# EAGLE schematic board1 (EAGLE 5.11)
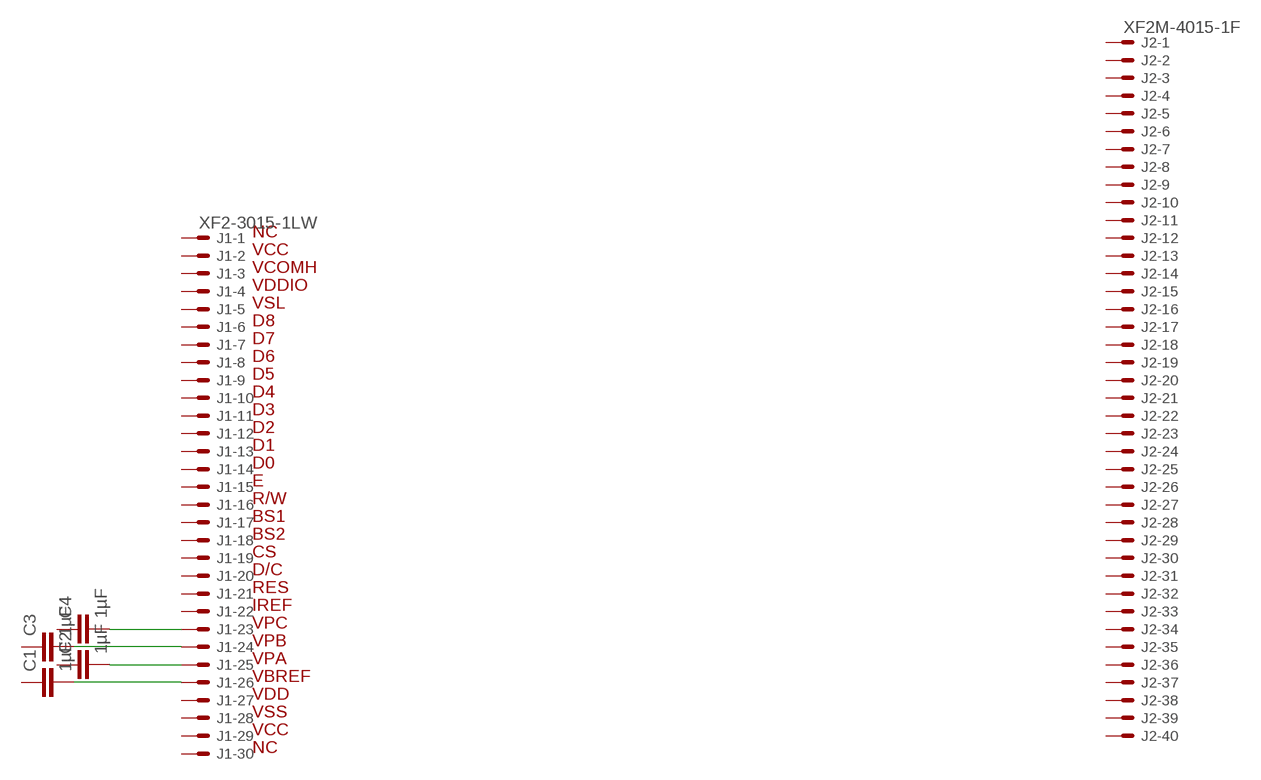
[diagram p0: schematic, sheet 1]

## Parts
C1  1µF  CAP0805  [0805]
C2  1µF  CAP0805  [0805]
C3  1µF  CAP0805  [0805]
C4  1µF  CAP0805  [0805]
J1  XF2-3015-1LW  [XF2H-3015-1LW]
J2  XF2M-4015-1F  [XF2M-4015-1F]

## Nets
N$1: C4.2 J1.23
N$2: C3.2 J1.24
N$3: C2.2 J1.25
N$4: C1.2 J1.26
Unconnected: C1.1 C2.1 C3.1 C4.1 J1.1 J1.2 J1.3 J1.4 J1.5 J1.6 J1.7 J1.8 J1.9 J1.10 J1.11 J1.12 J1.13 J1.14 J1.15 J1.16 J1.17 J1.18 J1.19 J1.20 J1.21 J1.22 J1.27 J1.28 J1.29 J1.30 J2.1 J2.2 J2.3 J2.4 J2.5 J2.6 J2.7 J2.8 J2.9 J2.10 J2.11 J2.12 J2.13 J2.14 J2.15 J2.16 J2.17 J2.18 J2.19 J2.20 J2.21 J2.22 J2.23 J2.24 J2.25 J2.26 J2.27 J2.28 J2.29 J2.30 J2.31 J2.32 J2.33 J2.34 J2.35 J2.36 J2.37 J2.38 J2.39 J2.40

## Notes on the sheet
- NC
- VCC
- VCOMH
- VDDIO
- VSL
- D8
- D7
- D6
- D5
- D4
- D3
- D2
- D1
- D0
- E
- R/W
- BS1
- BS2
- CS
- D/C
- RES
- IREF
- VPC
- VPB
- VPA
- VBREF
- VDD
- VSS
- VCC
- NC

## Library data of the parts
C1-C4 = SparkFun:CAP: Capacitor Standard 0603 ceramic capacitor, and 0.1" leaded capacitor.
J1 = con-omron:XF2*-30?: OMRON FPC Connector Source : http://www.omron.com/ecb/products/pdf/fpc.pdf; OC_FARNELL: unknown; OC_NEWARK: unknown
J2 = con-omron:XF2*-40?: OMRON FPC Connector Source : http://www.omron.com/ecb/products/pdf/fpc.pdf; OC_FARNELL: unknown; OC_NEWARK: unknown